# EAGLE design main-board (EAGLE 9.6.2)
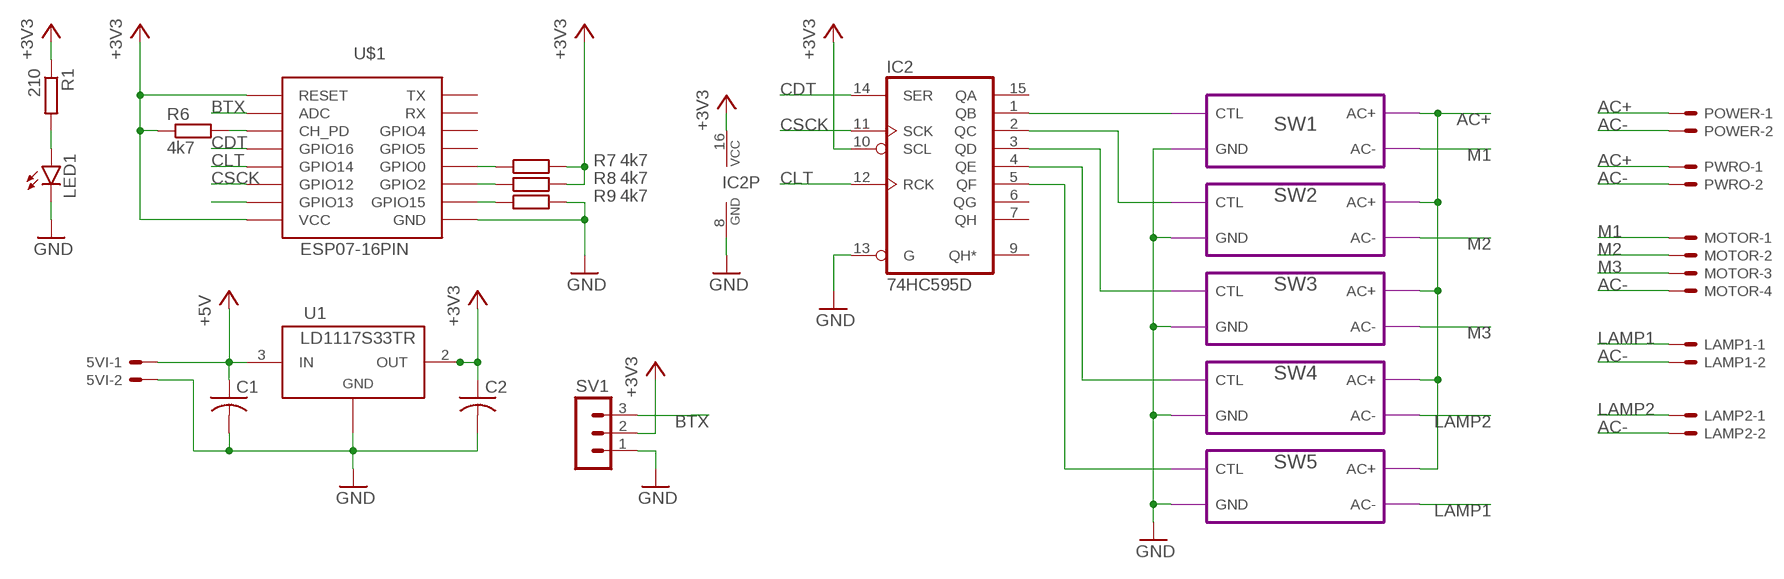
[diagram p0: schematic, sheet 1]

## Parts
5VI  KK-156-2  [KK-156-2]
C1  C-USC4532  [C4532]
C2  C-USC4532  [C4532]
IC2  74HC595D  [SO16]
LAMP1  KK-156-2  [KK-156-2]
LAMP2  KK-156-2  [KK-156-2]
LED1  LEDSML0603  [SML0603]
MOTOR  KK-156-4  [KK-156-4]
POWER  KK-156-2  [KK-156-2]
PWRO  KK-156-2  [KK-156-2]
R1  210  R-EU_R0805  [R0805]
R6  4k7  R-EU_R1206  [R1206]
R7  4k7  R-EU_R1206  [R1206]
R8  4k7  R-EU_R1206  [R1206]
R9  4k7  R-EU_R1206  [R1206]
SV1  MA03-1  [MA03-1]
U1  LD1117S33TR  [SOT-223]
U$1  ESP07-16PIN  [ESP07-16PIN]

## Module instances
SW1 = AC_SW
SW2 = AC_SW
SW3 = AC_SW
SW4 = AC_SW
SW5 = AC_SW

## Nets
+3V3 [VCC]: C2.1 IC2.10(SCL) IC2.16(VCC) R1.1 R6.1 R7.2 R8.2 SV1.2 U1.2(OUT) U1.4 U$1.REST(RESET) U$1.VCC
+5V [VCC]: 5VI.1 C1.1 U1.3(IN)
AC+ [AC]: POWER.1 PWRO.1 ; port SW1.AC+ SW2.AC+ SW3.AC+ SW4.AC+ SW5.AC+
AC- [AC]: LAMP1.2 LAMP2.2 MOTOR.4 POWER.2 PWRO.2
BTX: SV1.3 U$1.ADC
CDT: IC2.14(SER) U$1.GPIO16
CLT: IC2.12(RCK) U$1.GPIO14
CSCK: IC2.11(SCK) U$1.GPIO12
GND [VCC]: 5VI.2 C1.2 C2.2 IC2.8(GND) IC2.13(G) LED1.C R9.2 SV1.1 U1.1(ADJ/GND) U$1.GND ; port SW1.GND SW2.GND SW3.GND SW4.GND SW5.GND
LAMP1 [AC]: LAMP1.1 ; port SW5.AC-
LAMP2 [AC]: LAMP2.1 ; port SW4.AC-
M1 [AC]: MOTOR.1 ; port SW1.AC-
M2 [AC]: MOTOR.2 ; port SW2.AC-
M3 [AC]: MOTOR.3 ; port SW3.AC-
N$1: IC2.2(QC) ; port SW2.CTL
N$2: LED1.A R1.2
N$4: IC2.4(QE) ; port SW4.CTL
N$7: IC2.1(QB) ; port SW1.CTL
N$8: IC2.3(QD) ; port SW3.CTL
N$9: IC2.5(QF) ; port SW5.CTL
N$11: R6.2 U$1.CH_PD
N$12: R7.1 U$1.GPIO0
N$13: R8.1 U$1.GPIO2
N$14: R9.1 U$1.GPIO15
N$18: U$1.GPIO13
Unconnected: IC2.6(QG) IC2.7(QH) IC2.9(QH*) IC2.15(QA) U$1.GPIO4 U$1.GPIO5 U$1.RX U$1.TX

## Library data of the parts
5VI LAMP1 LAMP2 POWER PWRO = con-molex:KK-156-2: KK 156 HEADER Source: http://www.molex.com/pdm_docs/sd/026604100_sd.pdf; MF: MOLEX; OC_FARNELL: unknown; OC_NEWARK: unknown
C1 C2 = resistor:C-US: CAPACITOR, American symbol
IC2 = 74xx-eu:74*595: 8-bit SHIFT REGISTER, output latch
LED1 = led:LED: LED OSRAM: - CHIPLED LG R971, LG N971, LY N971, LG Q971, LY Q971, LO R971, LY R971 LH N974, LH R974 LS Q976, LO Q976, LY Q976 LO Q996 - Hyper CHIPLED LW Q18S LB Q993, LB Q99A, LB R99A - SideLED LS A670, LO A670, LY A670, LG A670, LP A670 LB A673, LV A673, LT A673, LW A673 LH A674 LY A675 LS A676, LA A676, LO A676, LY A676, LW A676 LS A679, LY A679, LG A679 - Hyper Micro SIDELED® LS Y876, LA Y876, LO Y876, LY Y876 LT Y87S - SmartLED LW L88C, LW L88S LB L89C, LB L89S, LG L890 LS L89K, LO L89K, LY L89K LS L896, LA L896, LO L896, LY L896 - TOPLED LS T670, LO T670, LY T670, LG T670, LP T670 LSG T670, LSP T670, LSY T670, LOP T670, LYG T670 LG T671, LOG T671, LSG T671 LB T673, LV T673, LT T673, LW T673 LH T674 LS T676, LA T676, LO T676, LY T676, LB T676, LH T676, LSB T676, LW T676 LB T67C, LV T67C, LT T67C, LS T67K, LO T67K, LY T67K, LW E67C LS E67B, LA E67B, LO E67B, LY E67B, LB E67C, LV E67C, LT E67C LW T67C LS T679, LY T679, LG T679 LS T770, LO T770, LY T770, LG T770, LP T770 LB T773, LV T773, LT T773, LW T773 LH T774 LS E675, LA E675, LY E675, LS T675 LS T776, LA T776, LO T776, LY T776, LB T776 LHGB T686 LT T68C, LB T68C - Hyper Mini TOPLED® LB M676 - Mini TOPLED Santana® LG M470 LS M47K, LO M47K, LY M47K Source: http://www.osram.convergy.de LUXEON: - LUMILED® LXK2-PW12-R00, LXK2-PW12-S00, LXK2-PW14-U00, LXK2-PW14-V00 LXK2-PM12-R00, LXK2-PM12-S00, LXK2-PM14-U00 LXK2-PE12-Q00, LXK2-PE12-R00, LXK2-PE12-S00, LXK2-PE14-T00, LXK2-PE14-U00 LXK2-PB12-K00, LXK2-PB12-L00, LXK2-PB12-M00, LXK2-PB14-N00, LXK2-PB14-P00, LXK2-PB14-Q00 LXK2-PR12-L00, LXK2-PR12-M00, LXK2-PR14-Q00, LXK2-PR14-R00 LXK2-PD12-Q00, LXK2-PD12-R00, LXK2-PD12-S00 LXK2-PH12-R00, LXK2-PH12-S00 LXK2-PL12-P00, LXK2-PL12-Q00, LXK2-PL12-R00 Source: www.luxeon.com KINGBRIGHT: KA-3528ASYC Source: www.kingbright.com
MOTOR = con-molex:KK-156-4: KK 156 HEADER Source: http://www.molex.com/pdm_docs/sd/026604100_sd.pdf; MF: MOLEX; OC_FARNELL: unknown; OC_NEWARK: unknown
R1 R6-R9 = resistor:R-EU_: RESISTOR, European symbol
SV1 = con-lstb:MA03-1: PIN HEADER; OC_FARNELL: unknown; OC_NEWARK: unknown
U1 = IC:LD1117S33TR: IC REG LINEAR 3.3V 800MA SOT223 Manufacturer's datasheet <http://www.st.com/content/ccc/resource/technical/document/datasheet/99/3b/7d/91/91/51/4b/be/CD00000544.pdf/files/CD00000544.pdf/jcr:content/translations/en.CD00000544.pdf>; CREATED_BY: PCBLayout.com; DIGIKEY_PART_NUMBER: 497-1242-2-ND; MANUFACTURER: STMicroelectronics; MPN: LD1117S33TR; PACKAGE: SOT-223
U$1 = esp8266modules:ESP07-16PIN: ESP8266 Wifi module 07 - 16 pins; DIMENSIONS: 22.0 x 16.0 mm; PINS: 16; PITCH: 0.078" / 2 mm

## Module AC_SW
Ports: CTL(io) GND(io) AC+(io) AC-(io)
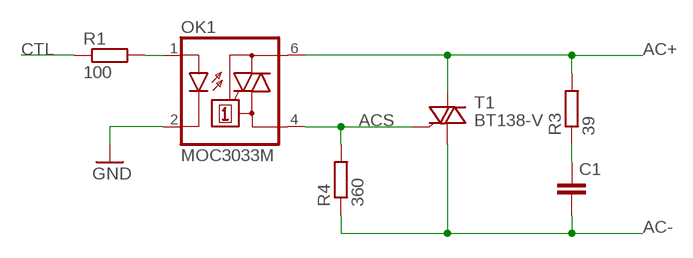
[diagram p1: schematic, module AC_SW, sheet 1]

### Parts
C1  C-EU050-030X075  [C050-030X075]
OK1  MOC3033M  [DIL06]
R1  100  R-EU_R1206  [R1206]
R3  39  R-EU_0204/7  [0204/7]
R4  360  R-EU_0204/7  [0204/7]
T1  BT138-V  [TO220BV]

### Nets
AC+ [AC]: OK1.6(A2) R3.2 T1.T2(A2)
AC- [AC]: C1.2 R4.1 T1.T1(A1)
ACS [ACS]: OK1.4(A1) R4.2 T1.G
CTL: R1.1
GND: OK1.2(C)
N$1: OK1.1(A) R1.2
N$8: C1.1 R3.1

### Library data of the parts
C1 = resistor:C-EU: CAPACITOR, European symbol
OK1 = optocoupler:MOC30*: 6-Pin DIP Zero-Cross Optoisolators Triac Driver Output (250/400 Volt Peak) Source: Data sheet <http://www.fairchildsemi.com/ds/MO/MOC3031M.pdf> The old path of data sheet not more available 2013-05-06.; MF: FAIRCHILD SEMICONDUCTOR; MPN: MOC3033-M; OC_FARNELL: 1133987; OC_NEWARK: 72K8898
R1 = resistor:R-EU_: RESISTOR, European symbol
R3 R4 = resistor:R-EU_: RESISTOR, European symbol; SPICEPREFIX: R
T1 = triac:BT138: TRIAC Source: http://www.semiconductors.philips.com BT138_SERIES_2.pdf

## Net classes
0 default: width 0.61 mm, clearance 0.254 mm
1 AC: width 2.032 mm, clearance 0.508 mm
2 VCC: width 0.762 mm, clearance 0.254 mm
3 ACS: width 0.61 mm, clearance 0.254 mm

## Board
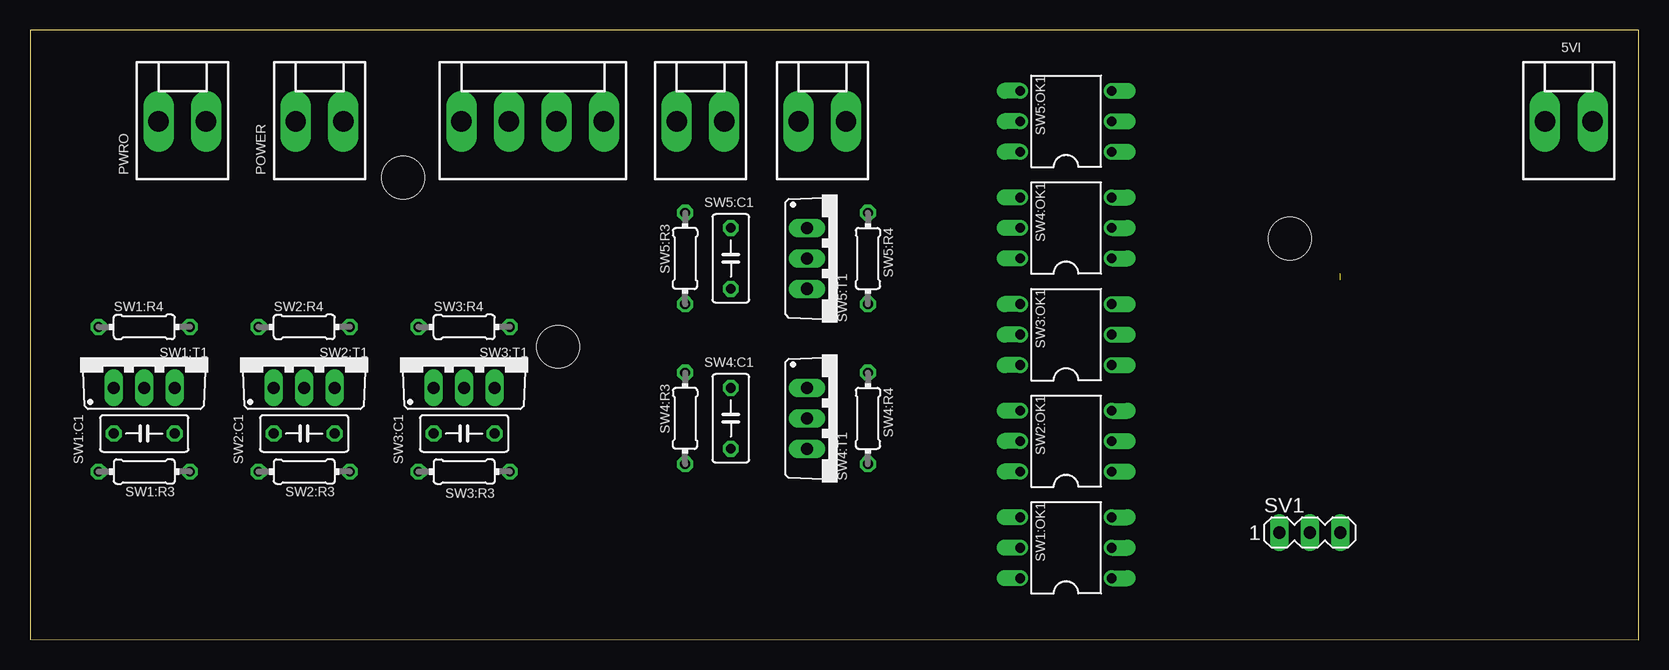
[diagram p2: board, top side]
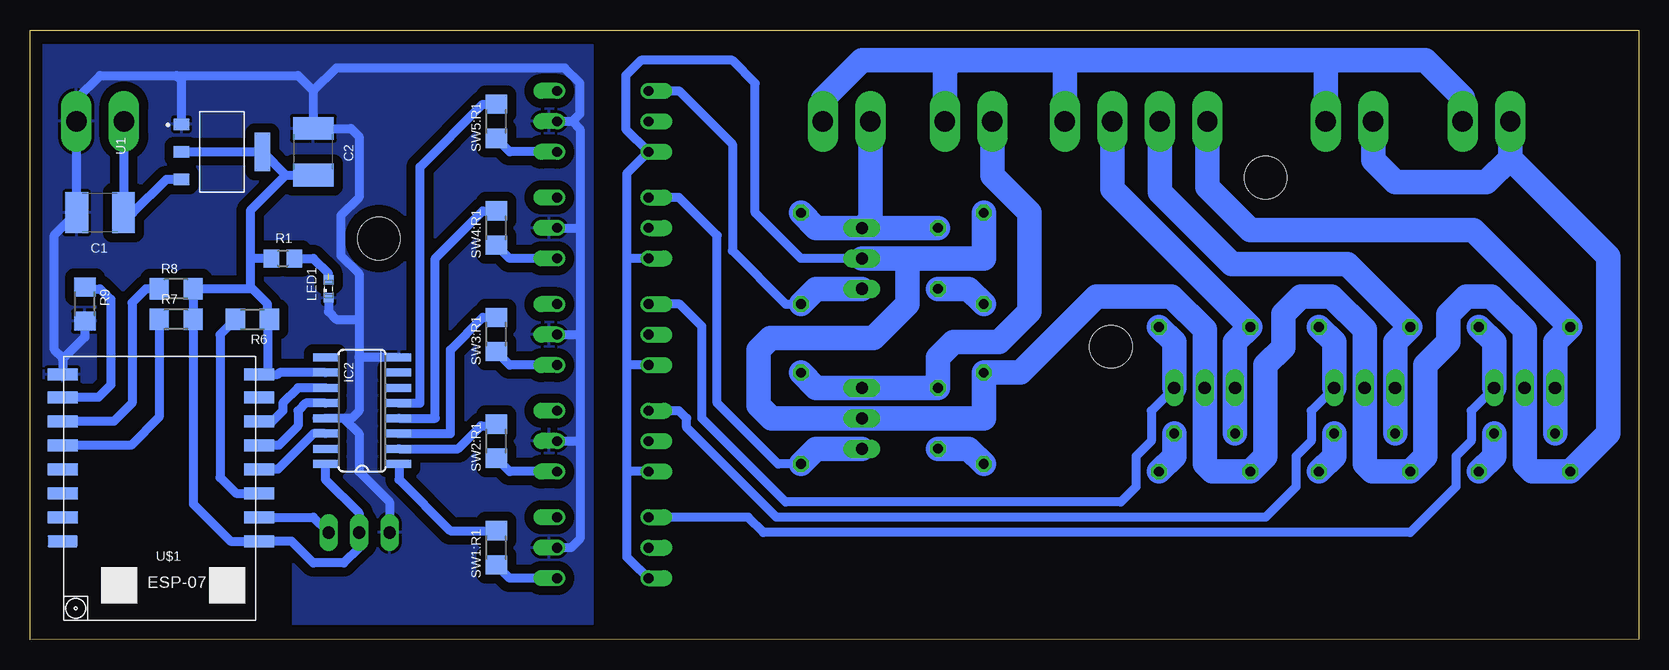
[diagram p3: board, bottom side, seen from below]

Size 134.11 x 50.85 mm. Coordinates in mm from the lower left corner, seen from the top.
Outline: 0,50.85 0,0.05 134.11,0 134.11,50.85 0,50.85
Copper layers (1*16): Top 0.035mm / dielectric 1.5mm / Bottom 0.035mm
Design rules "default": minimum track width 6mil, minimum drill 0.35mm, track to track 6mil, track to pad 6mil, pad to pad 6mil, via to via 6mil, smd to smd 6mil, copper to edge 40mil, drill to drill 6mil, minimum pad ring 10mil, minimum via ring 8mil, stop-mask expansion 4mil, vias tented up to drill 0mil, thermal gap 10mil
Holes 3.56 mm at 31.11,38.53 44.02,24.43 105.03,33.45
bRestrict: area 113,0.4 to 133.9,6.4

### Footprints (pad centres in the part's own frame; a part is rotated, then mirrored left to right if it is on the bottom)
KK-156-2 = drill 1.7 pad 2.184 long: 1 -1.98,0; 2 1.98,0
C4532 = smd 1.9 x 3.4: 1 -1.95,0; 2 1.95,0
SO16 = smd 0.66 x 2.032: 1 -4.445,-3.073; 2 -3.175,-3.073; 3 -1.905,-3.073; 4 -0.635,-3.073; 5 0.635,-3.073; 6 1.905,-3.073; 7 3.175,-3.073; 8 4.445,-3.073; 9 4.445,3.073; 10 3.175,3.073; 11 1.905,3.073; 12 0.635,3.073; 13 -0.635,3.073; 14 -1.905,3.073; 15 -3.175,3.073; 16 -4.445,3.073
SML0603 = smd 0.8 x 0.8: A 0.75,0; C -0.75,0
KK-156-4 = drill 1.7 pad 2.184 long: 1 -5.94,0; 2 -1.98,0; 3 1.98,0; 4 5.94,0
R0805 = smd 1.3 x 1.5: 1 -0.95,0; 2 0.95,0
R1206 = smd 1.6 x 1.803: 1 -1.422,0; 2 1.422,0
MA03-1 = drill 1.016 long: 1 -2.54,0; 2 0,0; 3 2.54,0
C050-030X075 = drill 0.813 octagon: 1 -2.54,0; 2 2.54,0
DIL06 = drill 0.813 offset: 1 -2.54,-3.81; 2 0,-3.81; 3 2.54,-3.81; 4 2.54,3.81; 5 0,3.81; 6 -2.54,3.81
0204/7 = drill 0.813 octagon: 1 -3.81,0; 2 3.81,0
TO220BV = drill 1.016 long: G 2.54,-2.54; T1 -2.54,-2.54; T2 0,-2.54
SOT-223 = smd 1.26 x 0.96: 1 -3.375,2.3; 2 -3.375,0; 3 -3.375,-2.3 | smd 1.26 x 3.19: 4 3.375,0
ESP07-16PIN = smd 2.5 x 1: ADC -8.2,3.8; CH_PD -8.2,1.8; GND 8.2,-8.105; GPIO0 8.2,-2.2; GPIO2 8.2,-4.2; GPIO4 8.2,1.8; GPIO5 8.2,-0.2; GPIO12 -8.2,-4.2; GPIO13 -8.2,-6.2; GPIO14 -8.2,-2.2; GPIO15 8.2,-6.2; GPIO16 -8.2,-0.2; REST -8.2,5.8; RX 8.2,3.8; TX 8.2,5.8; VCC -8.2,-8.105

### Placement (x,y rotation side)
5VI  128.27,43.23 0 top
C1  128.27,35.61 180 bottom
C2  110.49,40.69 90 bottom
IC2  106.43,19.1 90 bottom
LAMP1  66.04,43.23 0 top
LAMP2  55.88,43.23 0 top
LED1  109.22,29.26 90 bottom
MOTOR  41.91,43.23 0 top
POWER  24.13,43.23 0 top
PWRO  12.7,43.23 0 top
R1  113.03,31.8 0 bottom
R6  115.57,26.72 180 bottom
R7  121.92,26.72 0 bottom
R8  121.92,29.26 0 bottom
R9  129.54,27.99 270 bottom
SV1  106.68,8.94 0 top
SW1:C1  [C050-030X075]  9.53,17.2 180 top
SW1:OK1  MOC3033M  [DIL06]  86.36,7.67 90 top
SW1:R1  100  [R1206]  95.25,7.67 270 bottom
SW1:R3  39  [0204/7]  9.53,14.02 180 top
SW1:R4  360  [0204/7]  9.53,26.09 0 top
SW1:T1  BT138-V  [TO220BV]  9.53,23.55 0 top
SW2:C1  [C050-030X075]  22.86,17.2 180 top
SW2:OK1  MOC3033M  [DIL06]  86.36,16.56 90 top
SW2:R1  100  [R1206]  95.25,16.56 270 bottom
SW2:R3  39  [0204/7]  22.86,14.02 180 top
SW2:R4  360  [0204/7]  22.86,26.09 0 top
SW2:T1  BT138-V  [TO220BV]  22.86,23.55 0 top
SW3:C1  [C050-030X075]  36.2,17.2 180 top
SW3:OK1  MOC3033M  [DIL06]  86.36,25.45 90 top
SW3:R1  100  [R1206]  95.25,25.45 270 bottom
SW3:R3  39  [0204/7]  36.2,14.02 180 top
SW3:R4  360  [0204/7]  36.2,26.09 0 top
SW3:T1  BT138-V  [TO220BV]  36.2,23.55 0 top
SW4:C1  [C050-030X075]  58.42,18.47 90 top
SW4:OK1  MOC3033M  [DIL06]  86.36,34.34 90 top
SW4:R1  100  [R1206]  95.25,34.34 270 bottom
SW4:R3  39  [0204/7]  54.61,18.47 90 top
SW4:R4  360  [0204/7]  69.85,18.47 270 top
SW4:T1  BT138-V  [TO220BV]  67.31,18.47 270 top
SW5:C1  [C050-030X075]  58.42,31.8 90 top
SW5:OK1  MOC3033M  [DIL06]  86.36,43.23 90 top
SW5:R1  100  [R1206]  95.25,43.23 270 bottom
SW5:R3  39  [0204/7]  54.61,31.8 90 top
SW5:R4  360  [0204/7]  69.85,31.8 270 top
SW5:T1  BT138-V  [TO220BV]  67.31,31.8 270 top
U1  118.11,40.69 0 bottom
U$1  123.19,14.02 180 bottom

### Tracks (layer width: path | path; a pad name or v marks a point on that pad's centre or on a via)
+3V3
  Bottom 0.762: 114.3,22.13 113.46,22.13 113.31,22.28 IC2.10 | 114.3,22.13 U$1.VCC | U1.2 U1.4 112.78,38.74 | 112.78,38.74 C2.1 | 112.78,38.74 115.74,35.78 115.74,31.8 | 115.57,29.26 114.3,27.99 114.3,26.87 R6.1 114.3,26.57 114.3,22.13 | 115.57,29.26 R8.2 R7.2 120.5,11.33 117.39,8.22 U$1.REST 112.31,8.22 110.49,6.4 107.95,6.4 106.68,7.67 SV1.2 106.68,10.57 109.5,13.39 IC2.16 | 115.74,31.8 115.74,29.43 115.57,29.26 | R1.1 115.74,31.8
+5V
  Bottom 0.762: 5VI.1 126.32,43.2 C1.1 125.53,35.61 122.75,38.39 U1.3
AC+
  Bottom 0.762: SW1:OK1.6 83.26,5.84 83.31,5.84 84.38,6.91 84.38,14.02 | 84.38,31.8 84.38,38.86 SW5:OK1.6 84.45,42.6 84.45,47.04 83.19,48.31 75.56,48.31 73.66,46.41 73.66,35.61 69.85,31.8 SW5:T1.T2 | 84.38,31.8 84.38,22.91 | 84.38,22.91 84.38,14.02 | SW4:OK1.6 84.38,31.8 | SW3:OK1.6 84.38,22.91 | SW2:OK1.6 84.38,14.02
  Bottom 2.032: PWRO.1 10.72,40.13 | 10.72,40.13 12.7,38.15 20.32,38.15 22.15,39.98 POWER.1 | SW5:T1.T2 60.96,31.8 | 60.96,31.8 54.61,31.8 SW5:R3.2 | 60.96,31.8 60.96,27.99 63.78,25.17 72.39,25.17 73.38,24.18 73.38,19.54 72.3,18.47 SW4:T1.T2 54.61,18.47 SW4:R3.2 51.56,22.28 45.22,28.63 38.95,28.63 36.2,25.87 SW3:T1.T2 36.2,14.66 35.56,14.02 SW3:R3.2 31.11,15.29 31.11,22.91 29.64,24.39 29.64,27.15 28.16,28.63 25.62,28.63 22.86,25.87 SW2:T1.T2 22.86,14.66 22.23,14.02 SW2:R3.2 17.78,15.29 17.78,22.91 15.88,24.82 15.88,27.14 14.39,28.63 12.28,28.63 9.53,25.87 SW1:T1.T2 9.53,14.66 8.89,14.02 SW1:R3.2 2.54,17.2 2.54,31.95 10.72,40.13
AC-
  Bottom 2.032: PWRO.2 14.68,45.21 17.78,48.31 26.67,48.31 | 26.67,48.31 48.26,48.31 | 48.26,48.31 57.15,48.31 | 57.15,48.31 64.77,48.31 68.02,45.06 LAMP1.2 | POWER.2 26.11,47.75 26.67,48.31 | MOTOR.4 47.85,47.9 48.26,48.31 | LAMP2.2 57.86,47.6 57.15,48.31
BTX
  Bottom 0.762: U$1.ADC 110.5,10.22 SV1.3
CDT
  Bottom 0.762: IC2.14 110.47,17.2 113.45,14.22 U$1.GPIO16
CLT
  Bottom 0.762: IC2.12 111.12,19.74 111.76,19.1 111.76,17.83 113.37,16.22 U$1.GPIO14
CSCK
  Bottom 0.762: 114.82,18.22 U$1.GPIO12 113.91,18.22 113.03,19.1 113.03,19.74 111.76,21.01 IC2.11
GND
  Bottom 0.762: 131.39,23.4 U$1.GND | 131.39,23.4 129.54,25.25 R9.2 | SW5:OK1.2 88.9,43.23 | 88.9,43.23 88.27,42.6 88.27,34.34 | 88.27,34.34 88.27,25.45 | 88.27,25.45 88.27,16.56 SW2:OK1.2 | 88.27,16.69 88.27,8.43 89.03,7.67 SW1:OK1.2 | SW4:OK1.2 88.27,34.34 | SW3:OK1.2 88.27,25.45 | 121.92,47.04 128.27,47.04 130.25,45.06 5VI.2 130.22,43.2 C1.2 132.08,33.75 132.08,24.18 131.39,23.49 131.39,23.4 | 121.92,47.04 111.76,47.04 110.49,45.77 | 110.49,45.77 C2.2 107.36,42.64 106.68,41.96 106.68,36.88 108.2,35.36 108.2,32.05 106.68,30.53 106.68,26.72 | U1.1 121.48,46.61 121.92,47.04 | 106.68,26.72 106.68,23.55 | 106.68,23.55 106.68,19.1 107.31,18.47 107.95,18.47 | 107.95,18.47 IC2.13 | IC2.8 106.68,23.55 | LED1.C 109.22,27.36 108.58,26.72 106.68,26.72 | 88.9,43.23 88.27,43.87 88.27,46.41 89.53,47.68 108.58,47.68 110.49,45.77 | 107.95,18.47 106.68,17.2 106.68,14.02 104.14,11.48 SV1.1
  pour Bottom (isolate 0.762): 87.25,49.58 87.25,1.32 133.35,1.32 133.35,49.58
LAMP1
  Bottom 2.032: SW5:C1.2 SW5:T1.T1 | SW5:T1.T1 68.58,34.34 SW5:R4.1 | SW5:T1.T1 64.06,35.05 LAMP1.1
LAMP2
  Bottom 2.032: SW4:R4.1 68.58,21.01 SW4:T1.T1 SW4:C1.2 58.42,23.55 57.15,24.82 53.34,24.82 50.8,27.36 50.8,35.61 53.9,38.71 LAMP2.1
M1
  Bottom 2.032: SW1:C1.2 SW1:T1.T1 6.99,24.82 SW1:R4.1 13.79,34.16 32.4,34.16 35.97,37.73 MOTOR.1
M2
  Bottom 2.032: SW2:C1.2 SW2:T1.T1 20.32,24.82 SW2:R4.1 24.31,31.34 33.94,31.34 39.93,37.33 MOTOR.2
M3
  Bottom 2.032: SW3:C1.2 SW3:T1.T1 33.66,24.82 32.4,26.08 | 32.4,26.08 SW3:R4.1 | MOTOR.3 43.89,37.57 32.4,26.08
N$1
  Bottom 0.762: IC2.2 98.42,15.93 96.52,17.83 95.4,17.83 SW2:R1.1
N$2  (1 unrouted)
  Bottom 0.762: R1.2 110.49,31.8 109.22,30.53
N$4
  Bottom 0.762: IC2.4 100.33,18.47 100.33,31.8 96.37,35.76 SW4:R1.1
N$7
  Bottom 0.762: IC2.1 103.35,13.36 99.08,9.09 SW1:R1.1
N$8
  Bottom 0.762: IC2.3 99.06,17.2 99.06,24.18 96.37,26.87 SW3:R1.1
N$9
  Bottom 0.762: IC2.5 101.6,19.74 101.6,39.42 96.37,44.65 SW5:R1.1
N$11
  Bottom 0.762: R6.2 118.26,25.45 118.26,13.54 116.94,12.22 U$1.CH_PD
N$12
  Bottom 0.762: R7.1 123.34,18.57 125.69,16.22 U$1.GPIO0
N$13
  Bottom 0.762: R8.1 124.46,29.26 125.6,28.12 125.6,19.74 127.12,18.22 U$1.GPIO2
N$14
  Bottom 0.762: R9.1 129.39,29.26 128.27,29.26 127.38,28.37 127.38,21.26 128.42,20.22 U$1.GPIO15
SW1:ACS
  Bottom 0.762: SW1:T1.G 13.97,19.1 13.97,16.56 15.24,15.29 15.24,12.75 19.05,8.94 72.97,8.94 74.24,10.21 SW1:OK1.4
  Bottom 2.032: SW1:T1.G 12.06,24.82 SW1:R4.2
SW1:N$1
  Bottom 0.762: SW1:OK1.1 94.13,5.13 SW1:R1.2
SW1:N$8
  Bottom 2.032: SW1:C1.1 12.06,15.29 SW1:R3.1
SW2:ACS
  Bottom 0.61: 81.23,19.1 SW2:OK1.4
  Bottom 0.762: SW2:T1.G 27.3,19.1 27.3,16.56 28.57,15.29 28.57,12.75 31.11,10.21 71.89,10.21 79.38,17.7 79.38,18.47 80.01,19.1 SW2:OK1.4
  Bottom 2.032: SW2:T1.G 25.4,24.82 SW2:R4.2
SW2:N$1
  Bottom 0.762: SW2:OK1.1 94.13,14.02 SW2:R1.2
SW2:N$8
  Bottom 2.032: SW2:C1.1 25.4,15.29 SW2:R3.1
SW3:ACS
  Bottom 0.762: SW3:T1.G 40.64,19.1 40.64,16.56 41.91,15.29 41.91,12.75 43.18,11.48 71.12,11.48 78.11,18.47 78.11,26.14 79.96,27.99 SW3:OK1.4
  Bottom 2.032: SW3:T1.G 38.73,24.82 SW3:R4.2
SW3:N$1
  Bottom 0.762: SW3:OK1.1 94.13,22.91 SW3:R1.2
SW3:N$8
  Bottom 2.032: SW3:C1.1 38.73,15.29 SW3:R3.1
SW4:ACS
  Bottom 0.762: SW4:R4.2 71.75,14.66 76.83,19.74 76.83,33.71 80.01,36.88 SW4:OK1.4
  Bottom 2.032: SW4:T1.G 68.58,15.93 SW4:R4.2
SW4:N$1
  Bottom 0.762: SW4:OK1.1 94.13,31.8 SW4:R1.2
SW4:N$8
  Bottom 2.032: SW4:C1.1 55.88,15.93 SW4:R3.1
SW5:ACS
  Bottom 0.762: SW5:R4.2 71.12,27.99 75.56,32.44 75.56,41.33 80.01,45.77 SW5:OK1.4
  Bottom 2.032: SW5:T1.G 68.58,29.26 SW5:R4.2
SW5:N$1
  Bottom 0.762: SW5:OK1.1 94.13,40.69 SW5:R1.2
SW5:N$8
  Bottom 2.032: SW5:C1.1 55.88,29.26 SW5:R3.1